# Altium schematic sheet Potentiometer.SchDoc
size A4
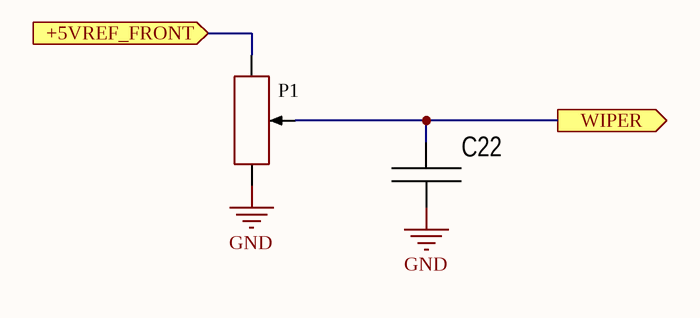
[diagram p0: Potentiometer.SchDoc]

## Parts
C22  (no value)  [CAP: 1206]
P1  (no value)  [СП4-2МА]

## Ports
+5VREF_FRONT (in), WIPER (out)

## Nets
GND: C22.1 P1.1(CCW)
+5VREF_FRONT: P1.3(CW) ; port +5VREF_FRONT
WIPER: C22.2 P1.2 ; port WIPER

## Library data of the parts
C22 = Ceramic_1206: Manufacturer: Yageo; PartNumber: CC1206KRX7R9BB104; ValueManufacturerPartNumber: Ceramic capacitor, 0.1μF, 1206; TypeCapacitor: Ceramic capacitor; Tolerance: ±10%; TypeDielectric: X7R; Voltage: 50V; Value: 0.1μF; Package: 1206; HelpURL: https://www.digikey.com/product-detail/en/yageo/CC1206KRX7R9BB104/311-1179-1-ND/303089; Temperature: -55...+125°C
P1 = СП4-2МА: ValueManufacturerPartNumber: СП4-2МА; PartNumber: СП4-2МА